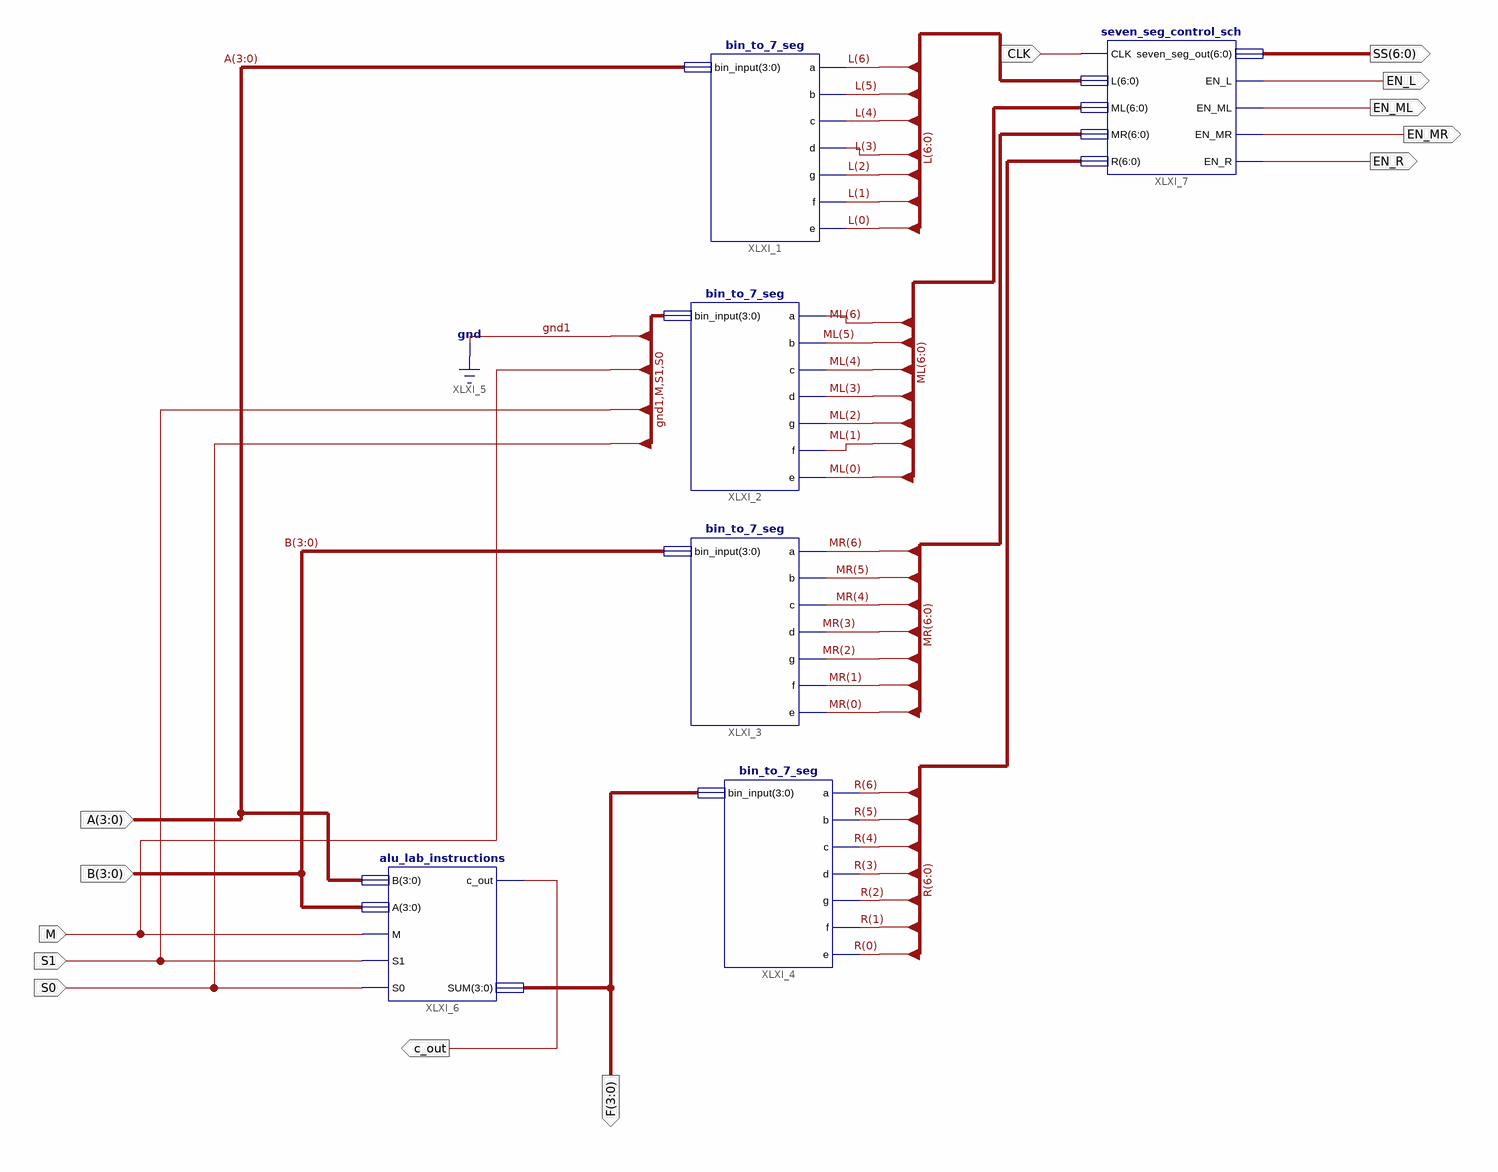
[diagram p0: schematic sheet 1]
// Xilinx ISE schematic alu_to_7_seg.sch (spartan3e) as structural Verilog: 6 symbols, 13 ports
module alu_to_7_seg (
  input  [3:0] A,
  input  [3:0] B,
  input  M,
  input  S1,
  input  S0,
  input  CLK,
  output c_out,
  output [3:0] F,
  output [6:0] SS,
  output EN_L,
  output EN_ML,
  output EN_R,
  output EN_MR
);

  wire [6:0] L, ML, MR, R;

  bin_to_7_seg XLXI_1 (.bin_input(A), .a(L[6]), .b(L[5]), .c(L[4]), .d(L[3]), .g(L[2]), .f(L[1]), .e(L[0]));
  bin_to_7_seg XLXI_2 (
    .bin_input({1'b0, M, S1, S0}), .a(ML[6]), .b(ML[5]), .c(ML[4]), .d(ML[3]), .g(ML[2]), .f(ML[1]), .e(ML[0]));
  bin_to_7_seg XLXI_3 (.bin_input(B), .a(MR[6]), .b(MR[5]), .c(MR[4]), .d(MR[3]), .g(MR[2]), .f(MR[1]), .e(MR[0]));
  bin_to_7_seg XLXI_4 (.bin_input(F), .a(R[6]), .b(R[5]), .c(R[4]), .d(R[3]), .g(R[2]), .f(R[1]), .e(R[0]));
  alu_lab_instructions XLXI_6 (.B(A), .A(B), .M(M), .S1(S1), .S0(S0), .c_out(c_out), .SUM(F));
  seven_seg_control_sch XLXI_7 (
    .CLK(CLK), .L(L), .ML(ML), .MR(MR), .R(R), .EN_MR(EN_MR), .EN_L(EN_L), .EN_ML(EN_ML), .EN_R(EN_R),
    .seven_seg_out(SS));
endmodule
